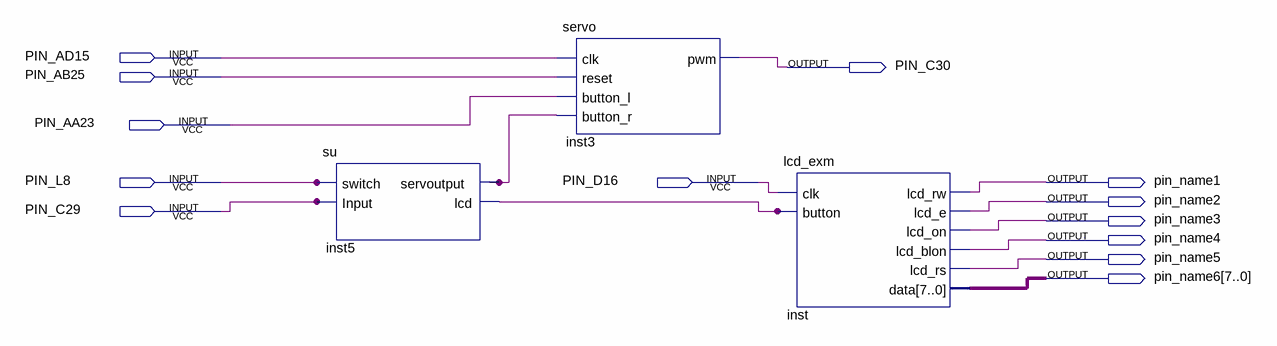
[diagram p0: schematic sheet]
// Quartus schematic suveservo.bdf as structural Verilog: 3 symbols, 13 pins
module suveservo (
  input  PIN_AD15,
  input  PIN_AB25,
  input  PIN_AA23,
  input  PIN_L8,
  input  PIN_D16,
  input  PIN_C29,
  output PIN_C30,
  output pin_name1,
  output pin_name2,
  output pin_name3,
  output pin_name4,
  output pin_name5,
  output [7:0] pin_name6
);

  wire inst5_lcd, inst5_servoutput;

  su inst5 (.switch(PIN_L8), .Input(PIN_C29), .servoutput(inst5_servoutput), .lcd(inst5_lcd));
  servo inst3 (.clk(PIN_AD15), .reset(PIN_AB25), .button_l(PIN_AA23), .button_r(inst5_servoutput), .pwm(PIN_C30));
  lcd_exm inst (
    .clk(PIN_D16), .button(inst5_lcd), .lcd_rw(pin_name1), .lcd_e(pin_name2), .lcd_on(pin_name3),
    .lcd_blon(pin_name4), .lcd_rs(pin_name5), .data(pin_name6));
endmodule
